# Altium schematic sheet HDMI.SchDoc
size A3
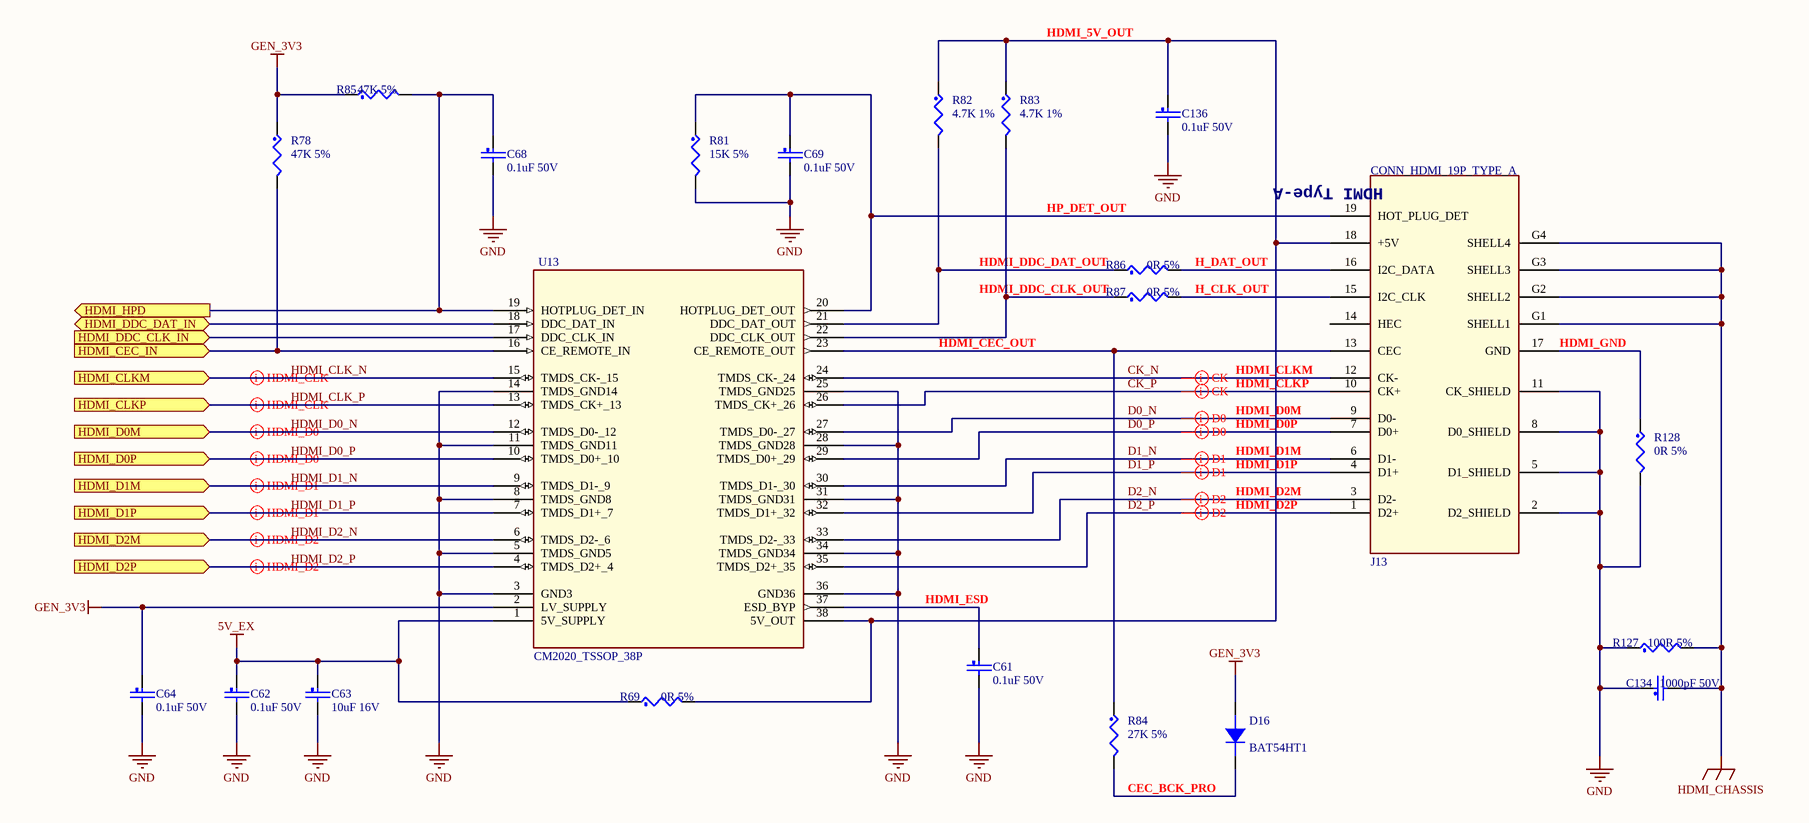
[diagram p0: HDMI.SchDoc]

## Parts
C61  0.1uF 50V  [SC0603]
C62  0.1uF 50V  [SC0603]
C63  10uF 16V  [SC0805]
C64  0.1uF 50V  [SC0603]
C68  0.1uF 50V  [SC0603]
C69  0.1uF 50V  [SC0603]
C134  1000pF 50V  [SC0603]
C136  0.1uF 50V  [SC0603]
D16  BAT54HT1  [SOD323]
J13  CONN_HDMI_19P_TYPE_A  [HDMI-A-LIANSHENG]
R69  0R 5%  [SR0603]
R78  47K 5%  [SR0603]
R81  15K 5%  [SR0603]
R82  4.7K 1%  [SR0603]
R83  4.7K 1%  [SR0603]
R84  27K 5%  [SR0603]
R85  47K 5%  [SR0603]
R86  0R 5%  [SR0603]
R87  0R 5%  [SR0603]
R127  100R 5%  [SR0603]
R128  0R 5%  [SR0603]
U13  CM2020_TSSOP_38P  [TSSOP38-0P5-9P8X4P5]

## Ports
HDMI_CEC_IN (in), HDMI_CLKM (in), HDMI_CLKP (in), HDMI_D0M (in), HDMI_D0P (in), HDMI_D1M (in), HDMI_D1P (in), HDMI_D2M (in), HDMI_D2P (in), HDMI_DDC_CLK_IN (in), HDMI_DDC_DAT_IN (bidir), HDMI_HPD (out)

## Nets
5V_EX: C62.1 C63.1 R69.1 U13.1(5V_SUPPLY)
GEN_3V3: C64.1 D16.1 R78.1 R85.1 U13.2(LV_SUPPLY)
GND: C61.2 C62.2 C63.2 C64.2 C68.2 C69.2 C134.1 C136.2 J13.2(D2_SHIELD) J13.5(D1_SHIELD) J13.8(D0_SHIELD) J13.11(CK_SHIELD) R81.2 R127.1 R128.2 U13.3(GND3) U13.5(TMDS_GND5) U13.8(TMDS_GND8) U13.11(TMDS_GND11) U13.14(TMDS_GND14) U13.25(TMDS_GND25) U13.28(TMDS_GND28) U13.31(TMDS_GND31) U13.34(TMDS_GND34) U13.36(GND36)
HDMI_CHASSIS: C134.2 J13.G1(SHELL1) J13.G2(SHELL2) J13.G3(SHELL3) J13.G4(SHELL4) R127.2
CK_N: J13.12(CK-) U13.24(TMDS_CK-_24)
CK_P: J13.10(CK+) U13.26(TMDS_CK+_26)
D0_N: J13.9(D0-) U13.27(TMDS_D0-_27)
D0_P: J13.7(D0+) U13.29(TMDS_D0+_29)
D1_N: J13.6(D1-) U13.30(TMDS_D1-_30)
D1_P: J13.4(D1+) U13.32(TMDS_D1+_32)
D2_N: J13.3(D2-) U13.33(TMDS_D2-_33)
D2_P: J13.1(D2+) U13.35(TMDS_D2+_35)
HDMI_CEC_IN: R78.2 U13.16(CE_REMOTE_IN) ; port HDMI_CEC_IN
HDMI_CLK_N: U13.15(TMDS_CK-_15) ; port HDMI_CLKM
HDMI_CLK_P: U13.13(TMDS_CK+_13) ; port HDMI_CLKP
HDMI_D0_N: U13.12(TMDS_D0-_12) ; port HDMI_D0M
HDMI_D0_P: U13.10(TMDS_D0+_10) ; port HDMI_D0P
HDMI_D1_N: U13.9(TMDS_D1-_9) ; port HDMI_D1M
HDMI_D1_P: U13.7(TMDS_D1+_7) ; port HDMI_D1P
HDMI_D2_N: U13.6(TMDS_D2-_6) ; port HDMI_D2M
HDMI_D2_P: U13.4(TMDS_D2+_4) ; port HDMI_D2P
HDMI_DDC_CLK_IN: U13.17(DDC_CLK_IN) ; port HDMI_DDC_CLK_IN
HDMI_DDC_DAT_IN: U13.18(DDC_DAT_IN) ; port HDMI_DDC_DAT_IN
HDMI_HPD: C68.1 R85.2 U13.19(HOTPLUG_DET_IN) ; port HDMI_HPD
NetC61_1: C61.1 U13.37(ESD_BYP)
NetC69_1: C69.1 J13.19(HOT_PLUG_DET) R81.1 U13.20(HOTPLUG_DET_OUT)
NetC136_1: C136.1 J13.18(+5V) R69.2 R82.1 R83.1 U13.38(5V_OUT)
NetD16_2: D16.2 R84.2
NetJ13_13: J13.13(CEC) R84.1 U13.23(CE_REMOTE_OUT)
NetJ13_15: J13.15(I2C_CLK) R87.2
NetJ13_16: J13.16(I2C_DATA) R86.2
NetJ13_17: J13.17(GND) R128.1
NetR82_2: R82.2 R86.1 U13.21(DDC_DAT_OUT)
NetR83_2: R83.2 R87.1 U13.22(DDC_CLK_OUT)

Not connected (* = marked no-connect by the designer): J13 14(HEC)

## Layout directives
differential pair: CK_N, CK_P, D0_N, D0_P, D1_N, D1_P, D2_N, D2_P, HDMI_CLK_N, HDMI_CLK_P, HDMI_D0_N, HDMI_D0_P, HDMI_D1_N, HDMI_D1_P, HDMI_D2_N, HDMI_D2_P

## Notes on the sheet
- HDMI_5V_OUT
- HP_DET_OUT
- HDMI_DDC_DAT_OUT
- H_DAT_OUT
- HDMI_CEC_OUT
- HDMI_DDC_CLK_OUT
- H_CLK_OUT
- (near J13) HDMI_GND
- HDMI_CLKM
- HDMI_CLKP
- HDMI_D0M
- HDMI_D0P
- HDMI_D1M
- HDMI_D1P
- HDMI_D2M
- HDMI_D2P
- HDMI_ESD
- CEC_BCK_PRO
- (in symbol CONN_HDMI_19P_TYPE_A) HDMI Type-A

## Library data of the parts
C61-C64 C68 C69 C134 C136 = CAP_NP: CLASS: DISCRETE
D16 = DIODE_0
R69 R78 R81-R87 R127 R128 = RES: CLASS: DISCRETE
U13 = CM2020_TSSOP_38P: CLASS: IC